# EAGLE board loa_v3 (EAGLE 6.5.0), part 1 of 2
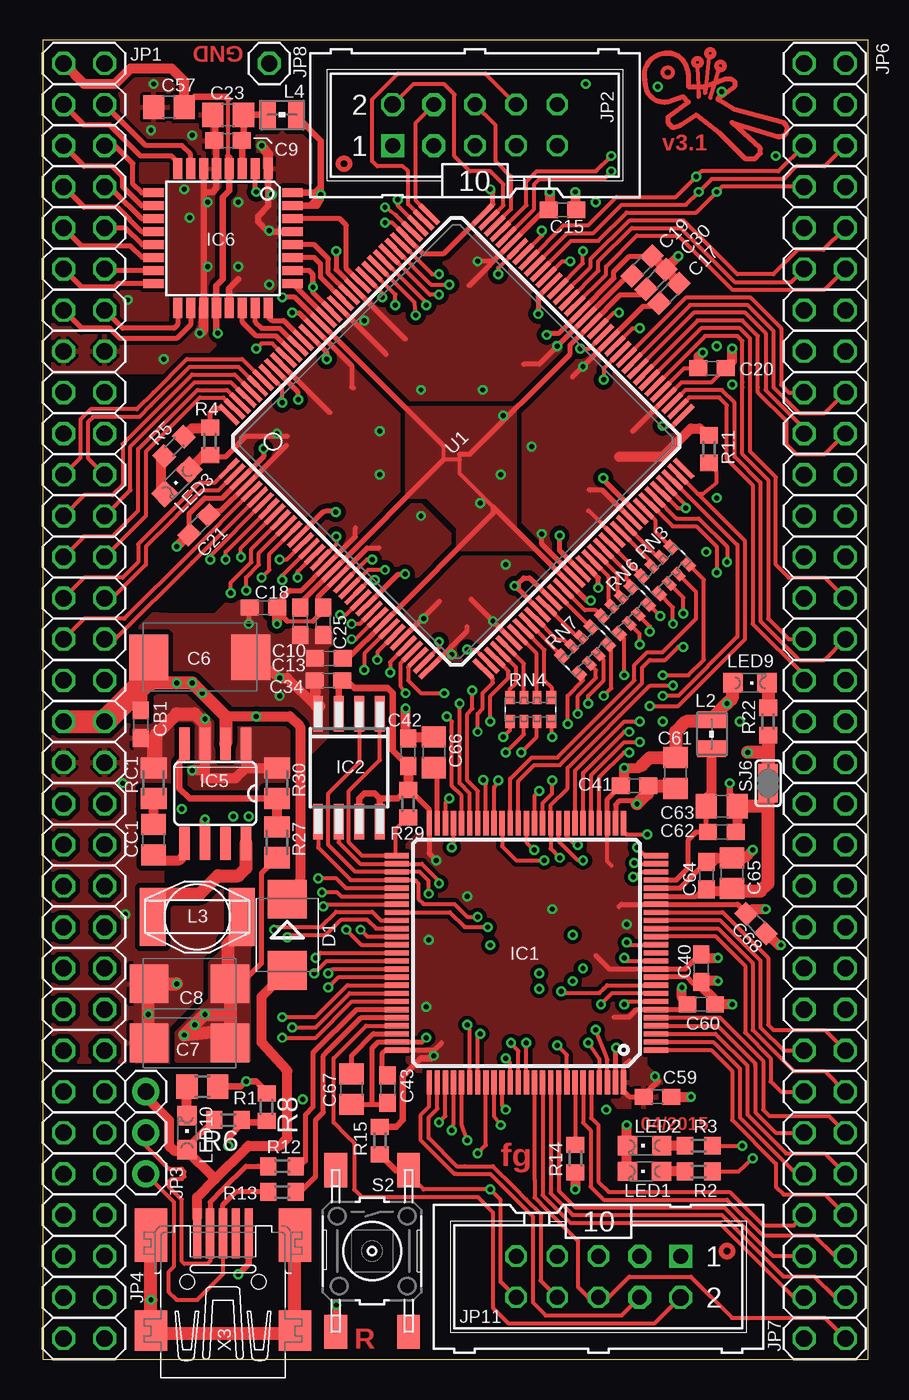
[diagram p7: board, top side]
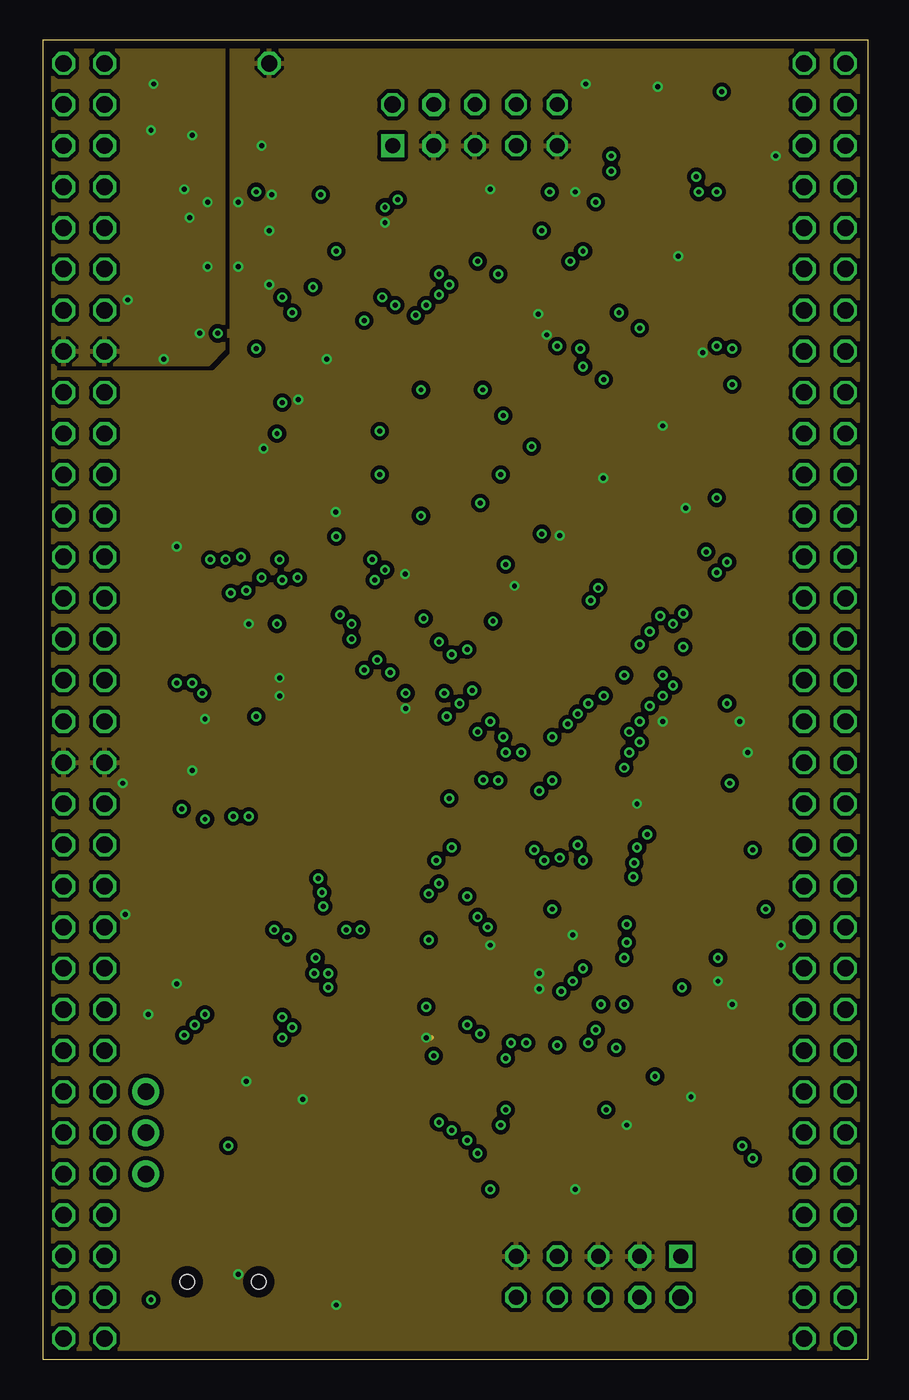
[diagram p8: board, inner layer GND]
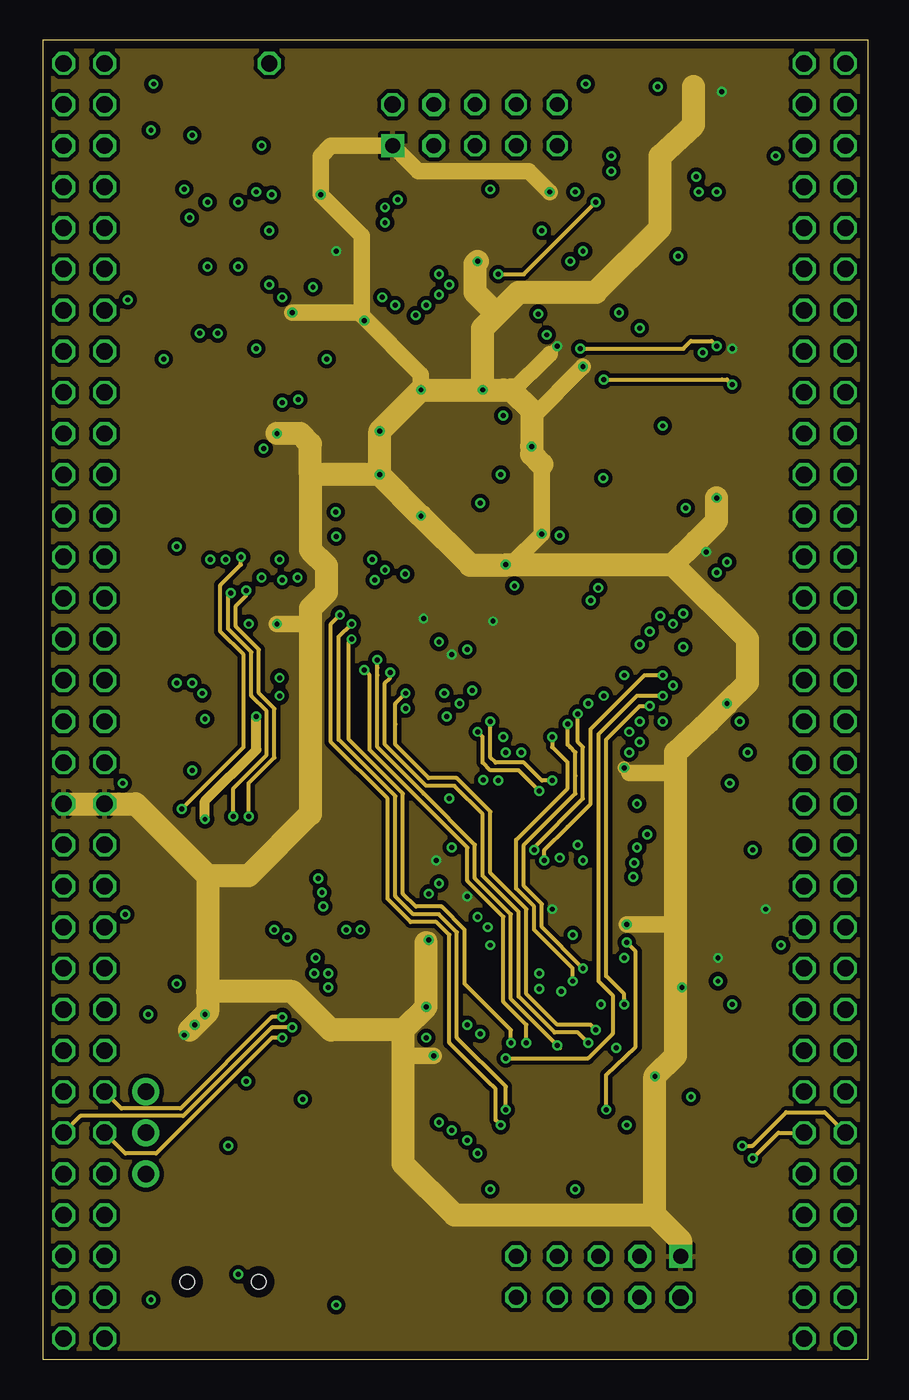
[diagram p9: board, inner layer Route15]
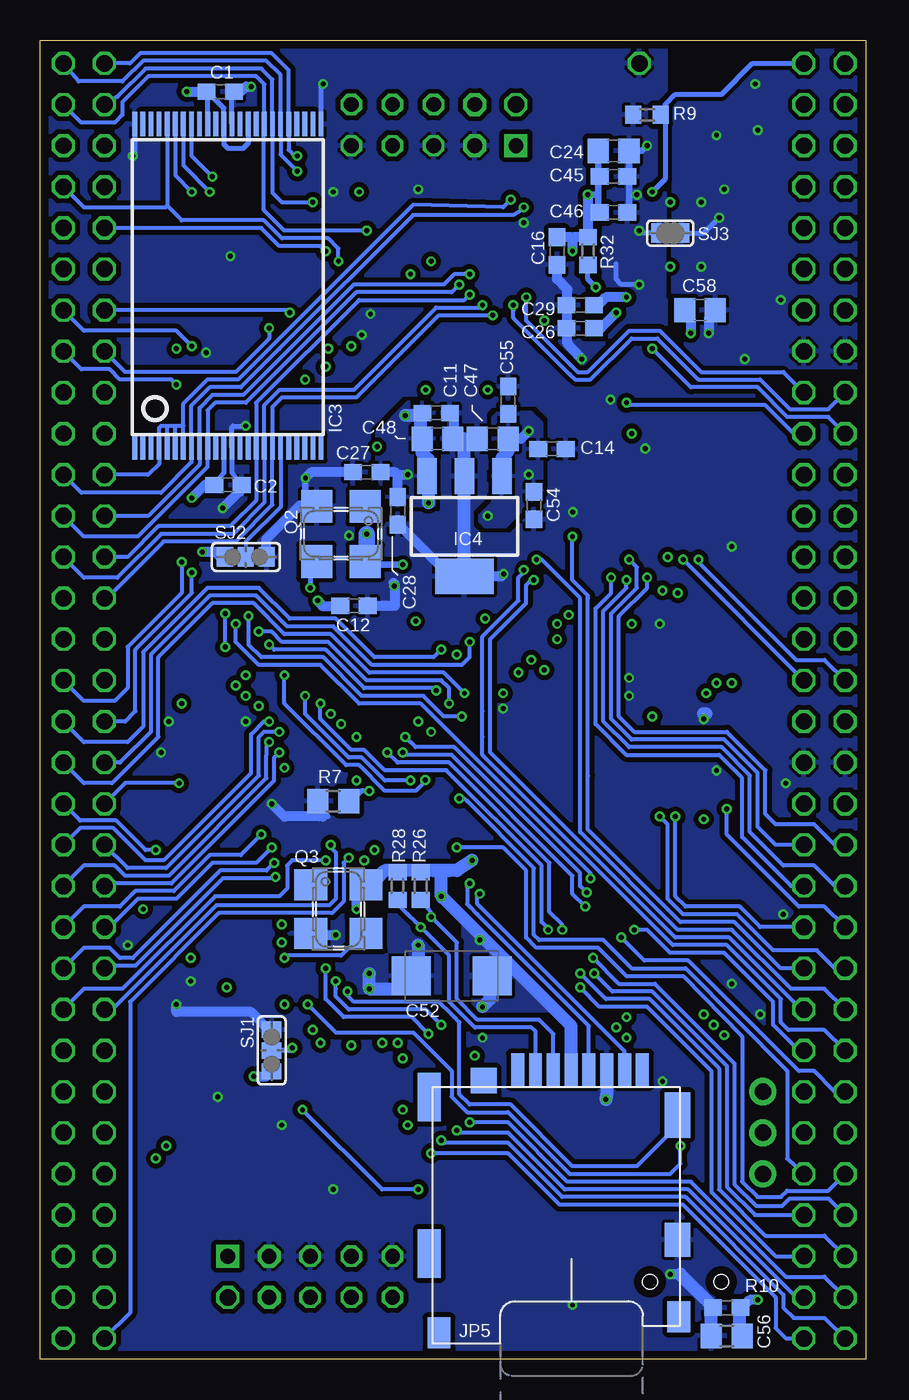
[diagram p10: board, bottom side, seen from below]

Size 50.94 x 81.43 mm. Coordinates in mm from the lower left corner, seen from the top.
Outline: 0,0 50.94,0 50.94,81.43 0,81.43 0,0
Copper layers (1+2*15+16): Top 0.035mm / dielectric 1.5mm / GND 0.035mm / dielectric 0.15mm / Route15 0.035mm / dielectric 0.2mm / Bottom 0.035mm
Design rules "PCB-POOL *": minimum track width 6mil, minimum drill 12mil, track to track 6mil, track to pad 6mil, pad to pad 6mil, via to via 6mil, smd to smd 6mil, copper to edge 20mil, drill to drill 8mil, minimum pad ring 8mil, minimum via ring 6mil, stop-mask expansion 12mil, vias tented up to drill 12mil, thermal gap 8mil

## Footprints (pad centres in the part's own frame; a part is rotated, then mirrored left to right if it is on the bottom)
C0603 = smd 1.1 x 1: 1 -0.85,0; 2 0.85,0
SMC_D = smd 2.4 x 2.8: + -3.15,0; - 3.15,0
SMC_C = smd 2.4 x 2.4: + -2.5,0; - 2.5,0
C0805 = smd 1.3 x 1.5: 1 -0.95,0; 2 0.95,0
SMB = smd 2.4 x 2.4: A 2.2,0; C -2.2,0
TQFP100 = smd 1.5 x 0.33: 1 -8,6; 2 -8,5.5; 3 -8,5; 4 -8,4.5; 5 -8,4; 6 -8,3.5; 7 -8,3; 8 -8,2.5; 9 -8,2; 10 -8,1.5; 11 -8,1; 12 -8,0.5; 13 -8,0; 14 -8,-0.5; 15 -8,-1; 16 -8,-1.5; 17 -8,-2; 18 -8,-2.5; 19 -8,-3; 20 -8,-3.5; 21 -8,-4; 22 -8,-4.5; 23 -8,-5; 24 -8,-5.5; 25 -8,-6; 51 8,-6; 52 8,-5.5; 53 8,-5; 54 8,-4.5; 55 8,-4; 56 8,-3.5; 57 8,-3; 58 8,-2.5; 59 8,-2; 60 8,-1.5; 61 8,-1; 62 8,-0.5; 63 8,0; 64 8,0.5; 65 8,1; 66 8,1.5; 67 8,2; 68 8,2.5; 69 8,3; 70 8,3.5; 71 8,4; 72 8,4.5; 73 8,5; 74 8,5.5; 75 8,6 | smd 0.33 x 1.5: 26 -6,-8; 27 -5.5,-8; 28 -5,-8; 29 -4.5,-8; 30 -4,-8; 31 -3.5,-8; 32 -3,-8; 33 -2.5,-8; 34 -2,-8; 35 -1.5,-8; 36 -1,-8; 37 -0.5,-8; 38 0,-8; 39 0.5,-8; 40 1,-8; 41 1.5,-8; 42 2,-8; 43 2.5,-8; 44 3,-8; 45 3.5,-8; 46 4,-8; 47 4.5,-8; 48 5,-8; 49 5.5,-8; 50 6,-8; 76 6,8; 77 5.5,8; 78 5,8; 79 4.5,8; 80 4,8; 81 3.5,8; 82 3,8; 83 2.5,8; 84 2,8; 85 1.5,8; 86 1,8; 87 0.5,8; 88 0,8; 89 -0.5,8; 90 -1,8; 91 -1.5,8; 92 -2,8; 93 -2.5,8; 94 -3,8; 95 -3.5,8; 96 -4,8; 97 -4.5,8; 98 -5,8; 99 -5.5,8; 100 -6,8
SO-08M = smd 0.6 x 2.2: 1 -1.905,-3.33; 2 -0.635,-3.33; 3 0.635,-3.33; 4 1.905,-3.33; 5 1.905,3.33; 6 0.635,3.33; 7 -0.635,3.33; 8 -1.905,3.33
TSOP48 = smd 1.5 x 0.3: 1 -9.909,5.75; 2 -9.909,5.25; 3 -9.909,4.75; 4 -9.909,4.25; 5 -9.909,3.75; 6 -9.909,3.25; 7 -9.909,2.75; 8 -9.909,2.25; 9 -9.909,1.75; 10 -9.909,1.25; 11 -9.909,0.75; 12 -9.909,0.25; 13 -9.909,-0.25; 14 -9.909,-0.75; 15 -9.909,-1.25; 16 -9.909,-1.75; 17 -9.909,-2.25; 18 -9.909,-2.75; 19 -9.909,-3.25; 20 -9.909,-3.75; 21 -9.909,-4.25; 22 -9.909,-4.75; 23 -9.909,-5.25; 24 -9.909,-5.75; 25 10.068,-5.75; 26 10.068,-5.25; 27 10.068,-4.75; 28 10.068,-4.25; 29 10.068,-3.75; 30 10.068,-3.25; 31 10.068,-2.75; 32 10.068,-2.25; 33 10.068,-1.75; 34 10.068,-1.25; 35 10.068,-0.75; 36 10.068,-0.25; 37 10.068,0.25; 38 10.068,0.75; 39 10.068,1.25; 40 10.068,1.75; 41 10.068,2.25; 42 10.068,2.75; 43 10.068,3.25; 44 10.068,3.75; 45 10.068,4.25; 46 10.068,4.75; 47 10.068,5.25; 48 10.068,5.75
SOT223 = smd 1.219 x 2.235: 1 -2.311,-3.099; 2 0,-3.099; 3 2.311,-3.099 | smd 3.6 x 2.2: 4 0,3.099
SO08 = smd 0.66 x 2.032: 1 -1.905,-3.073; 2 -0.635,-3.073; 3 0.635,-3.073; 4 1.905,-3.073; 5 1.905,3.073; 6 0.635,3.073; 7 -0.635,3.073; 8 -1.905,3.073
TQFP32-08 = smd 1.27 x 0.559: 1 -4.293,2.8; 2 -4.293,2; 3 -4.293,1.2; 4 -4.293,0.4; 5 -4.293,-0.4; 6 -4.293,-1.2; 7 -4.293,-2; 8 -4.293,-2.8; 17 4.293,-2.8; 18 4.293,-2; 19 4.293,-1.2; 20 4.293,-0.4; 21 4.293,0.4; 22 4.293,1.2; 23 4.293,2; 24 4.293,2.8 | smd 0.559 x 1.27: 9 -2.8,-4.293; 10 -2,-4.293; 11 -1.2,-4.293; 12 -0.4,-4.293; 13 0.4,-4.293; 14 1.2,-4.293; 15 2,-4.293; 16 2.8,-4.293; 25 2.8,4.293; 26 2,4.293; 27 1.2,4.293; 28 0.4,4.293; 29 -0.4,4.293; 30 -1.2,4.293; 31 -2,4.293; 32 -2.8,4.293
2X16 = drill 1.016 octagon: 1 -19.05,-1.27; 2 -19.05,1.27; 3 -16.51,-1.27; 4 -16.51,1.27; 5 -13.97,-1.27; 6 -13.97,1.27; 7 -11.43,-1.27; 8 -11.43,1.27; 9 -8.89,-1.27; 10 -8.89,1.27; 11 -6.35,-1.27; 12 -6.35,1.27; 13 -3.81,-1.27; 14 -3.81,1.27; 15 -1.27,-1.27; 16 -1.27,1.27; 17 1.27,-1.27; 18 1.27,1.27; 19 3.81,-1.27; 20 3.81,1.27; 21 6.35,-1.27; 22 6.35,1.27; 23 8.89,-1.27; 24 8.89,1.27; 25 11.43,-1.27; 26 11.43,1.27; 27 13.97,-1.27; 28 13.97,1.27; 29 16.51,-1.27; 30 16.51,1.27; 31 19.05,-1.27; 32 19.05,1.27
ML10 = drill 0.914 pad 1.422 square: 1 -5.08,-1.27 | drill 1.016 pad 1.422 octagon: 2 -5.08,1.27 | drill 0.914 pad 1.422 octagon: 3 -2.54,-1.27; 4 -2.54,1.27 | drill 0.914 octagon: 5 0,-1.27; 6 0,1.27; 7 2.54,-1.27; 8 2.54,1.27; 9 5.08,-1.27; 10 5.08,1.27
1X03S = drill 1.016 pad 1.676: 1 -2.54,0; 2 0,0; 3 2.54,0
SD_MOLEX_49225-0821 = smd 0.8 x 2: 1 -2.43,8.5; 2 -1.33,8.5; 3 -0.23,8.5; 4 0.87,8.5; 5 1.97,8.5; 6 3.07,8.5; 7 4.17,8.5; 8 5.27,8.5 | smd 1.4 x 1.9: 11 7.51,-6.75; 12 -7.29,-7.75 | smd 1.4 x 3: 13 -7.89,-2.85; 14 -7.89,6.8 | smd 1.6 x 1.55: 15 -4.53,7.825 | smd 1.55 x 2.8: SW1 7.435,5.7 | smd 1.55 x 2.1: SW2 7.435,-2
1X01 = drill 1.016 octagon: 1 0,0
WE-KI_0805_B = smd 1.02 x 1.78: 1 -0.89,0; 2 0.89,0
L-PISG = smd 1.6 x 3.6: 1 -2.75,0; 2 2.75,0
CHIPLED_0805 = smd 1.2 x 1.2: A 0,-1.05; C 0,1.05
XO53 = smd 1.93 x 2.032: 1 -1.5,-1.7; 2 1.5,-1.7; 3 1.5,1.7; 4 -1.5,1.7
R0805 = smd 1.3 x 1.5: 1 -0.95,0; 2 0.95,0
R0603 = smd 1 x 1.1: 1 -0.85,0; 2 0.85,0
M0805 = smd 1.3 x 1.6: 1 -0.95,0; 2 0.95,0
EXB38V = smd 0.6 x 0.8: 1 -1.275,-0.75; 4 1.275,-0.75; 5 1.275,0.75; 8 -1.275,0.75 | smd 0.5 x 0.8: 2 -0.4,-0.75; 3 0.4,-0.75; 6 0.4,0.75; 7 -0.4,0.75
B3F-10XX-SMD = smd 2.1 x 1.4: P1 -5,2.25; P2 5,2.25; P3 -5,-2.25; P4 5,-2.25
SJ_2S = smd 1 x 1.2: 1 -1.286,0; 2 0,0; 3 1.286,0
SJS = smd 1 x 1.2: 1 -0.683,0; 2 0.683,0
TQ144 = smd 1.6 x 0.3: P1 -11.1,8.75; P2 -11.1,8.25; P3 -11.1,7.75; P4 -11.1,7.25; P5 -11.1,6.75; P6 -11.1,6.25; P7 -11.1,5.75; P8 -11.1,5.25; P9 -11.1,4.75; P10 -11.1,4.25; P11 -11.1,3.75; P12 -11.1,3.25; P13 -11.1,2.75; P14 -11.1,2.25; P15 -11.1,1.75; P16 -11.1,1.25; P17 -11.1,0.75; P18 -11.1,0.25; P19 -11.1,-0.25; P20 -11.1,-0.75; P21 -11.1,-1.25; P22 -11.1,-1.75; P23 -11.1,-2.25; P24 -11.1,-2.75; P25 -11.1,-3.25; P26 -11.1,-3.75; P27 -11.1,-4.25; P28 -11.1,-4.75; P29 -11.1,-5.25; P30 -11.1,-5.75; P31 -11.1,-6.25; P32 -11.1,-6.75; P33 -11.1,-7.25; P34 -11.1,-7.75; P35 -11.1,-8.25; P36 -11.1,-8.75; P73 11.1,-8.75; P74 11.1,-8.25; P75 11.1,-7.75; P76 11.1,-7.25; P77 11.1,-6.75; P78 11.1,-6.25; P79 11.1,-5.75; P80 11.1,-5.25; P81 11.1,-4.75; P82 11.1,-4.25; P83 11.1,-3.75; P84 11.1,-3.25; P85 11.1,-2.75; P86 11.1,-2.25; P87 11.1,-1.75; P88 11.1,-1.25; P89 11.1,-0.75; P90 11.1,-0.25; P91 11.1,0.25; P92 11.1,0.75; P93 11.1,1.25; P94 11.1,1.75; P95 11.1,2.25; P96 11.1,2.75; P97 11.1,3.25; P98 11.1,3.75; P99 11.1,4.25; P100 11.1,4.75; P101 11.1,5.25; P102 11.1,5.75; P103 11.1,6.25; P104 11.1,6.75; P105 11.1,7.25; P106 11.1,7.75; P107 11.1,8.25; P108 11.1,8.75 | smd 0.3 x 1.6: P37 -8.75,-11.1; P38 -8.25,-11.1; P39 -7.75,-11.1; P40 -7.25,-11.1; P41 -6.75,-11.1; P42 -6.25,-11.1; P43 -5.75,-11.1; P44 -5.25,-11.1; P45 -4.75,-11.1; P46 -4.25,-11.1; P47 -3.75,-11.1; P48 -3.25,-11.1; P49 -2.75,-11.1; P50 -2.25,-11.1; P51 -1.75,-11.1; P52 -1.25,-11.1; P53 -0.75,-11.1; P54 -0.25,-11.1; P55 0.25,-11.1; P56 0.75,-11.1; P57 1.25,-11.1; P58 1.75,-11.1; P59 2.25,-11.1; P60 2.75,-11.1; P61 3.25,-11.1; P62 3.75,-11.1; P63 4.25,-11.1; P64 4.75,-11.1; P65 5.25,-11.1; P66 5.75,-11.1; P67 6.25,-11.1; P68 6.75,-11.1; P69 7.25,-11.1; P70 7.75,-11.1; P71 8.25,-11.1; P72 8.75,-11.1; P109 8.75,11.1; P110 8.25,11.1; P111 7.75,11.1; P112 7.25,11.1; P113 6.75,11.1; P114 6.25,11.1; P115 5.75,11.1; P116 5.25,11.1; P117 4.75,11.1; P118 4.25,11.1; P119 3.75,11.1; P120 3.25,11.1; P121 2.75,11.1; P122 2.25,11.1; P123 1.75,11.1; P124 1.25,11.1; P125 0.75,11.1; P126 0.25,11.1; P127 -0.25,11.1; P128 -0.75,11.1; P129 -1.25,11.1; P130 -1.75,11.1; P131 -2.25,11.1; P132 -2.75,11.1; P133 -3.25,11.1; P134 -3.75,11.1; P135 -4.25,11.1; P136 -4.75,11.1; P137 -5.25,11.1; P138 -5.75,11.1; P139 -6.25,11.1; P140 -6.75,11.1; P141 -7.25,11.1; P142 -7.75,11.1; P143 -8.25,11.1; P144 -8.75,11.1
32005-201 = smd 3.1 x 0.5: 1 3,1.6; 2 3,0.8; 3 3,0; 4 3,-0.8; 5 3,-1.6 | smd 2.5 x 2: M1 -3,-4.45; M2 -3,4.45 | smd 3.3 x 2: M3 2.9,4.45; M4 2.9,-4.45 | hole 0.9: 0,2.2; 0,-2.2

## Placement (x,y rotation side)
C1  100n  [C0603]  39.85,78.26 0 bottom
C2  100n  [C0603]  39.37,53.98 0 bottom
C6  22µ  [SMC_D]  9.68,43.34 0 top
C7  22µ  [SMC_C]  9.05,19.53 180 top
C8  22µ  [SMC_C]  9.05,23.18 180 top
C9  100n  [C0603]  11.43,75.25 180 top
C10  10n  [C0603]  15.88,45.56 270 top
C11  10n  [C0603]  26.51,58.42 0 bottom
C12  10n  [C0603]  31.59,46.51 0 bottom
C13  10n  [C0603]  17.65,43.27 180 top
C14  100n  [C0603]  19.37,56.2 0 bottom
C15  100n  [C0603]  32.07,70.96 0 top
C16  100n  [C0603]  19.05,68.42 270 bottom
C17  100n  [C0603]  38.64,65.82 45 top
C18  100n  [C0603]  13.61,46.4 180 top
C19  100n  [C0603]  36.99,67.5 45 top
C20  100n  [C0603]  41.3,61.19 180 top
C21  100n  [C0603]  9.62,51.53 225 top
C23  1µ  [C0805]  11.43,76.83 180 top
C24  1µ  [C0805]  15.56,74.61 0 bottom
C25  100n  [C0603]  17.3,45.56 270 top
C26  100n  [C0603]  17.62,63.66 180 bottom
C27  100n  [C0603]  30.8,54.77 180 bottom
C28  100n  [C0603]  28.89,52.39 270 bottom
C29  100n  [C0603]  17.62,65.09 180 bottom
C30  100n  [C0603]  37.85,66.67 45 top
C34  100n  [C0603]  17.62,41.91 180 top
C40  100n  [C0603]  40.64,24.13 270 top
C41  100n  [C0603]  36.51,35.4 0 top
C42  100n  [C0603]  22.54,37.47 90 top
C43  100n  [C0603]  21.27,16.67 270 top
C45  100n  [C0603]  15.56,73.03 0 bottom
C46  100n  [C0603]  15.56,70.8 0 bottom
C47  4µ7  [C0805]  23.02,56.83 180 bottom
C48  1µ  [C0805]  26.43,56.83 0 bottom
C52  22µ  [SMC_C]  25.56,23.65 180 bottom
C54  100n  [C0603]  20.48,52.7 270 bottom
C55  100n  [C0603]  22.07,59.21 90 bottom
C56  10n  [C0603]  8.57,3.17 180 bottom
C57  1µ  [C0805]  7.78,77.31 180 top
C58  1µ  [C0805]  10.23,64.77 0 bottom
C59  100n  [C0603]  37.94,16.19 0 top
C60  100n  [C0603]  40.64,21.91 0 top
C61  4µ7  [C0805]  39.05,36.2 270 top
C62  10n  [C0603]  41.91,32.54 0 top
C63  1µ  [C0805]  41.91,34.13 0 top
C64  10n  [C0603]  40.96,29.84 270 top
C65  1µ  [C0805]  42.55,30 270 top
C66  4µ7  [C0805]  24.13,37.47 90 top
C67  4µ7  [C0805]  19.05,16.67 270 top
C68  100n  [C0603]  44.02,26.88 315 top
CB1  100n  [C0603]  6.03,39.21 270 top
CC1  6n8  [C0805]  6.83,32.07 90 top
D1  MURS 140  [SMB]  15.08,26.19 270 top
IC1  STM32F10XVXT6  [TQFP100]  29.84,25.08 180 top
IC2  M25P80MW  [SO-08M]  18.89,36.51 180 top
IC3  S34ML04G100TFI000  [TSOP48]  39.37,66.2 90 bottom
IC4  MCP1825S-1202E/DB  [SOT223]  24.77,51.44 180 bottom
IC5  NCP3170  [SO08]  10.64,34.92 180 top
IC6  AD7265SU  [TQFP32-08]  11.11,69.22 270 top
JP1  [2X16]  2.54,60.96 270 top
JP2  CORTEX_JTAGW  [ML10]  26.67,76.2 0 top
JP3  [1X03S]  6.35,13.97 270 top
JP4  [2X16]  2.54,20.32 270 top
JP5  SD_DETECT  [SD_MOLEX_49225-0821]  19.05,9.37 0 bottom
JP6  [2X16]  48.26,60.96 270 top
JP7  [2X16]  48.26,20.32 270 top
JP8  GND  [1X01]  13.97,80.01 0 top
JP11  CORTEX_JTAGW  [ML10]  34.29,5.08 180 top
L2  0,47u  [WE-KI_0805_B]  41.27,38.58 270 top
L3  4µ7  [L-PISG]  9.53,27.31 0 top
L4  0,47u  [WE-KI_0805_B]  14.76,76.83 180 top
LED1  Red  [CHIPLED_0805]  37.15,11.59 90 top
LED2  Yellow  [CHIPLED_0805]  37.15,13.18 90 top
LED3  Green  [CHIPLED_0805]  8.27,54.18 135 top
LED9  Green  [CHIPLED_0805]  43.66,41.75 270 top
LED10  Blue  [CHIPLED_0805]  8.89,13.97 0 top
Q2  50.000  [XO53]  32.38,50.96 180 bottom
Q3  25.000  [XO53]  32.54,27.78 270 bottom
R1  2k2  [R0805]  9.84,16.83 180 top
R2  330  [R0603]  40.48,11.59 0 top
R3  330  [R0603]  40.48,13.18 0 top
R4  10k  [R0603]  10.32,56.67 270 top
R5  330  [R0603]  8.1,56.36 225 top
R6  1k  [R0603]  11.43,14.76 180 top
R7  2k2  [R0805]  32.86,34.45 0 bottom
R8  2k2  [R0603]  13.81,15.56 270 top
R9  10k  [R0603]  13.49,76.83 0 bottom
R10  1M  [R0805]  8.57,1.43 0 bottom
R11  330  [R0603]  41.12,56.2 90 top
R12  22  [R0603]  14.76,11.91 180 top
R13  22  [R0603]  14.76,10.32 180 top
R14  100k  [R0603]  32.86,12.38 90 top
R15  2k2  [R0603]  20.8,13.49 90 top
R22  330  [R0603]  44.77,39.37 90 top
R26  10k  [R0603]  27.46,29.21 90 bottom
R27  24k9  [M0805]  14.45,31.91 270 top
R28  10k  [R0603]  28.89,29.21 90 bottom
R29  10k  [R0603]  22.54,34.29 90 top
R30  8k06  [M0805]  14.45,35.56 270 top
R32  10k  [R0603]  17.14,68.42 90 bottom
RC1  4k99  [M0805]  6.83,35.56 270 top
RN3  100  [EXB38V]  38.41,48.71 45 top
RN4  100  [EXB38V]  30.1,40.11 0 top
RN6  100  [EXB38V]  35.94,46.24 45 top
RN7  100  [EXB38V]  33.47,43.77 45 top
S2  Reset  [B3F-10XX-SMD]  20.32,6.67 270 top
SJ1  PDR_ON  [SJ_2S]  36.67,19.05 270 bottom
SJ2  WP  [SJ_2S]  38.26,49.53 0 bottom
SJ3  AGND-GND  [SJS]  12.06,69.53 180 bottom
SJ6  [SJS]  44.77,35.56 270 top
U1  6SLX9TQG144  [TQ144]  25.52,56.66 45 top
X3  MINI-USB  [32005-201]  11.11,4.76 90 top

## Tracks (layer width: path | path; a pad name or v marks a point on that pad's centre or on a via)
!ADC_CS  (via drill 0.3)
  Top 0.305: U1.P126 16.67,65.86 16.67,66.99 | 16.67,66.99 16.45,67.22 IC6.26 | 16.67,66.99 16.67,66.52 v16.67,66.2
  Bottom 0.305: v16.67,66.2 17.14,66.67 R32.1 17.14,67.63
!RESET  (via drill 0.3)
  Top 0.254: IC1.14 36.17,25.58 v36.04,25.72 | S2.P1 22.86,11.38 22.86,11.11 23.5,10.48 v27.62,10.48 28.26,9.84 28.26,4.76 JP11.10
  Top 0.406: S2.P1 21.77,11.67 R15.1
  Route15 0.254: v34.77,15.4 34.77,17.54 36.59,19.29 36.59,25.16 v36.04,25.72 | v36.04,25.72
  Bottom 0.254: v27.62,10.48 29.84,10.48 v34.77,15.4
!SD_CS  (via drill 0.3)
  Top 0.254: IC1.58 25.12,27.58 26.04,26.67 v27.46,26.67
  Bottom 0.254: v27.46,26.67 | v27.46,26.67 27.78,26.99 28.26,27.46 29.05,28.26 29.21,28.36 R28.1 | JP5.2 20.38,20.22 20.64,20.48 24.13,20.48 25.72,22.07 25.72,24.92 v27.46,26.67
+3V3  (via drill 0.3)
  Top 0.254: IC1.28 34.84,30.72 35.08,30.48 | 16.95,45.84 16.99,46.04 | C18.1 14.45,46.51 | C21.1 10.48,52.39 | 43.5,27.46 C68.1 43.88,27.94 v44.61,27.78 | 15.08,45.56 16.67,45.56 | U1.P60 33.68,52.39 33.66,52.39 | U1.P76 39.43,60.33 41.27,60.33 42,61.05 C20.1 42.16,61.2 42.23,61.28 | 43.5,27.46 | 41.75,79.69 41.2,77.87 41.51,78.82 41.65,78.88 | 41.12,80.41 40.88,78.18 40.92,78.62 | 40.4,79.85 40.48,77.95 40.48,78.58 40.16,78.58
  Top 0.305: 20.74,50.09 20.01,50.09 U1.P20 16.99,47.07 16.99,46.04 | 19.28,51.33 19.28,50.78 U1.P18 15.97,47.47 15.24,47.47 14.29,46.51 14.45,46.51 | 15.04,56.44 U1.P4 10.99,52.39 10.48,52.39 | U1.P135 17.71,58.46 | 19.16,59.98 19.05,60.01 19.05,61.36 U1.P129 15.8,64.61 v15.4,64.61 | 21.19,62.05 U1.P125 | 22.37,62.99 19.56,65.8 U1.P122 18.1,67.26 v18.1,68.42 | 26.31,66.3 U1.P103 | 36.41,57.3 U1.P76 | 32.7,60.66 U1.P86 37.04,65.01 37.7,65.01 37.91,65.21 C17.1 | 29.67,61.42 29.69,61.44 30.64,61.44 U1.P90 35.79,66.58 C19.1 | U1.P63 34.53,53.66 33.81,53.66 33.71,53.69 | U1.P53 30.8,50.32 30.8,51.12 30.75,51 | U1.P42 26.41,46.93 | U1.P36 26.19,44.96 26.19,45.21 | U1.P31 24.48,46.78 | 11.43,23.34 12.22,23.18 13.49,24.45 13.49,30.01 R27.2 | v17.14,71.91 16.45,71.22 | R29.2 22.54,35.24 23.84,33.94 IC1.50 23.84,31.23 v24.29,30.8 | 36.2,18.41 35.84,18.13 IC1.100 35.84,16.54 36.2,16.19 C59.1 | 35.24,21.11 36.2,21.11 36.35,21.27 36.66,21.58 IC1.6 39.47,21.58 C60.1 | 34.13,24.92 34.97,24.08 IC1.11 39.64,24.08 40.48,24.92 40.58,24.92 C40.1 | 35.56,27.94 35.7,28.08 IC1.19 42.88,28.08 43.5,27.46 | 24.61,19.53 24.16,19.08 IC1.75 21.15,19.08 20.95,18.89 20.95,17.84 C43.1 | U1.P103 31.05,71.03 C15.1 | C25.1 16.95,45.84 | IC1.28 34.84,34.58 C41.1 | C18.1 14.29,46.35 14.61,46.04 | 14.61,46.04 | 14.61,46.04 15.08,45.56 | 16.67,45.56 17.3,46.2 | R4.2 10.16,55.72 | 10.16,55.72 | 10.16,55.72 11.27,55.72 12.54,56.99 15.08,56.99 | U1.P103 27.8,67.79 v26.83,67.79 | 41.67,77.79 42.7,77.15 45.72,76.36 arc-37 45.96,75.96 45.88,75.64 arc-37 45.4,75.49 42.55,76.36 44.29,74.77 44.29,74.45 43.97,74.14 43.34,74.14 41.75,75.72 40.32,76.83 39.37,76.2 38.89,76.04 38.58,76.36 38.58,76.68 39.85,77.63 39.53,77.95 38.58,77.63 arc-74 37.31,78.26 arc-23 37.15,79.53 arc-74 38.42,80.64 arc-60 39.53,80.17 arc-30 39.85,79.22 39.85,78.58
  Top 0.305: 41.67,77.79 42.7,78.58 42.7,78.9 42.47,79.06 42.15,79.06 41.65,78.88 41.04,78.66 40.92,78.62 40.8,78.58 39.85,78.58 | 39.85,78.58 | 39.85,78.58 40.16,78.58 | 41.67,77.79 v41.91,78.26
  Top 0.406: IC6.31 16.45,71.22 16.76,71.22 | 16.76,71.22 16.92,71.22 17.14,71.6 | 17.14,72.39 17.14,72.07 17.09,72.02 17.14,71.96 v17.14,71.91 17.14,71.6 | IC6.32 16.77,72.02 17.14,72.39 | C59.1 37.09,16.3 37.94,17.14 | 18.26,39.63 IC2.3 18.26,41.91 18.41,42.07 C34.1 18.57,42.07 19.21,41.43 21.27,41.43 21.59,41.12 21.59,37.57 C42.1 | IC2.7 19.53,34.61 19.84,34.92 20.48,34.92 20.8,34.61 | 20.8,34.61 IC2.8 | R29.2 22.44,35.14 21.91,34.61 20.8,34.61 | R15.2 21.8,14.34 22.23,14.76 22.23,17.46 23.34,18.57 23.97,18.57 v24.13,18.73 | 17.14,72.39 17.14,75.25 15.72,76.68 L4.1 | 16.76,71.22 17.14,71.6
  Top 0.61: R29.2 C42.1 22.49,36.67 | C41.1 35.72,35.46 35.72,35.4 35.88,35.56 v35.88,36.51 36.83,36.51 36.99,36.67 | 41.5,39.37 L2.1 41.37,39.37 41.43,39.69 | C7.+ 10.91,20.2 10.79,20.32 v8.73,20 | R11.2 40.54,57.47 40.01,57.47 38.26,55.72 35.56,55.72 | v31.27,72.07 31.27,71.91 31.27,71.12 31.41,71.1 C15.1 | 17.3,46.2 C25.1 | C18.1 14.46,46.37 14.45,46.35 v14.45,45.4 | R4.2 9.92,55.82 LED3.A | 43.5,27.46 43.81,27.78 v44.61,27.78 | 42.23,61.28 42.55,61.59 v42.55,62.39 | C40.1 40.64,24.92 40.8,24.77 v41.67,24.77 | 39.85,21.91 39.45,22.3 v39.45,22.94 | v42.23,40.48 | 42.55,41.75
  Top 0.813: L3.2 12.12,26.4 11.43,25.56 11.43,23.34 11.11,23.06 C8.+ 11.59,23.18 11.59,21.27 | 11.59,20.32 11.59,20.04 C7.+ | 11.59,20.32 11.59,21.27 | 41.43,39.69 v42.23,40.48 42.55,40.8 42.55,41.75 LED9.A | C61.1 37.46,37.15 36.99,36.67 | 41.5,39.37 39.69,39.37 39.05,38.73 C61.1 | 11.59,21.27 v10,21.27 8.89,20.16 v8.73,20 11.59,20.32
  Route15 0.254: v40.96,49.85 40.32,50.48
  Route15 0.61: v31.75,62.55 31.27,62.07 | 31.27,62.07
  Route15 0.813: 28.55,49.03 v28.57,49.05 28.89,49.05 | v35.88,36.51 36.2,36.2
  Route15 1.016: 28.89,49.05 v30.8,50.96 | v30.8,50.96 30.8,55.24 | 22.23,18.73 v24.13,18.73 | v23.34,59.85 23.34,60.8 19.68,64.45 19.68,64.61 | 19.68,64.61 19.68,69.37 v17.14,71.91 | v17.14,71.91 | v15.4,64.61 | v15.4,64.61 19.68,64.61 | 31.27,62.07 28.89,59.69 28.89,59.85 | v33.34,61.28 30.16,58.1 30.16,58.58 | v31.27,72.07 30,73.34 23.18,73.34 JP2.1 17.78,74.93 17.14,74.3 v17.14,71.91 | v36.04,26.83 39.05,26.83 | 36.2,36.2 39.05,36.2 | v30.8,50.96 | 23.65,25.72 v23.81,25.88 | v14.45,45.4 16.35,45.4 16.51,45.24 | v42.23,40.48 | v23.65,21.75
  Route15 1.422: 28.55,49.03 26.38,49.03 v23.34,52.07 v20.8,54.61 | 30.8,55.24 30.16,55.88 v30.16,56.36 30.16,58.58 28.89,59.85 28.42,59.85 v27.15,59.85 | v27.15,59.85 v23.34,59.85 v20.8,57.31 v20.8,54.61 | 37.78,8.89 25.4,8.89 22.23,12.06 22.23,18.73 22.23,20.32 | 37.78,8.89 v37.78,17.46 39.05,18.73 39.05,26.83 39.05,36.2 39.05,37.47 41.12,39.37 v42.23,40.48 43.5,41.75 43.5,44.45 38.89,49.05 | 37.78,8.89 | 38.89,49.05 36.2,49.05 35.08,49.05 v28.57,49.05 | 37.78,8.89 39.37,7.3 JP11.1 | v20.8,54.61 16.51,54.61 | 16.51,54.61 16.51,49.97 U1.P18 17.49,47.34 16.51,46.35 16.51,45.24 16.51,33.66 12.7,29.84 10.16,29.84 | 16.51,54.61 16.51,56.52 15.88,57.15 v14.45,57.15 | 22.23,20.32 v23.65,21.75 23.65,25.72 | 22.23,20.32 17.78,20.32 15.4,22.7 10.16,22.7 | JP4.5 JP4.6 5.71,34.29 10.16,29.84 | 10.16,29.84 10.16,22.7 | 10.16,22.7 10.16,21.43 9.05,20.32 | v27.15,59.85 27.15,63.66 28.02,64.53 | 28.02,64.53 29.37,65.88 34.13,65.88 38.1,69.85 38.1,74.3 40.16,76.2 40.16,78.58 | 38.89,49.05 40.32,50.48 41.59,51.75 v41.59,53.18 | v26.83,67.79 26.67,67.63 26.67,65.88 28.02,64.53
  Bottom 0.254: v26.19,28.57 | v26.19,28.57 26.11,28.5 | 40.62,78.18 C1.1 40.8,78.26 | C2.1 40.22,53.92
  Bottom 0.305: IC3.39 40.62,78.18 | IC3.12 39.62,54.73 C2.1 | IC3.34 38.12,75.07 38.42,74.77 39.37,74.77 39.62,75.02 IC3.37 39.62,77.24 40.48,78.11 40.48,78.26 C1.1 40.7,78.11 40.64,77.95
  Bottom 0.406: Q2.4 30.84,49.05 v28.57,49.05 | C24.1 16.51,73.13 | 16.51,73.13 C45.1 | 16.51,73.13 16.51,72.07 | 16.51,72.07 16.51,70.91 C46.1 | v17.14,71.91 16.67,71.91 16.51,72.07
  Bottom 0.61: v17.14,71.91 17.14,70.96 R32.2 18.04,69.27 18.1,69.22 | v37.78,17.46 36.97,17.46 SJ1.3 | v20.8,57.31 21.27,56.83 C47.1 | C26.1 16.35,63.66 v15.4,64.61 | 18.1,69.22 v18.1,68.42 | 18.1,69.22 18.15,69.27 C16.1 | v31.43,27.78 31.43,28.42 30.8,29.05 | 40.22,53.92 40.8,53.98 v41.59,53.18 | v41.91,78.26 40.8,78.26 | v40.96,49.85 40.16,49.85 39.85,49.53 SJ2.1
  Bottom 0.813: IC4.1 22.45,55.65 22.07,56.04 C47.1 | JP5.4 18.18,20.56 26.11,28.5 v26.19,28.57 26.19,30.16 | 26.19,30.16 26.67,30.16 27.68,30.16 R26.2 | R26.2 27.78,30.16 29.11,30.16 | 29.11,30.16 R28.2 | 29.11,30.16 29.69,30.16 30.16,29.69 30.48,29.18 Q3.4 | R26.2 27.5,30.1 | v23.65,21.75 | v23.65,21.75 23.18,22.23 23.18,23.54 C52.+ | v24.29,30.8 | v24.29,30.8 25.24,30.16 25.72,30.16 26.19,30.16
  Bottom 1.016: v30.8,50.96 30.8,49.85 31.11,49.53 | Q3.4 30.84,29.1 30.8,29.05
  other vias: 19.84,64.14 25.24,43.5 23.5,45.72 27.78,45.56 9.37,20.64
  pour Top (isolate 0.305, rank 6): 25.96,43.19 25.07,43.19 12.05,56.21 12.05,57.11 25.07,70.13 25.96,70.13 38.99,57.11 38.99,56.21
  pour Top (isolate 0.254): 23.18,17.78 22.54,18.41 22.54,31.75 23.18,32.38 36.51,32.38 37.15,31.75 37.15,18.1 38.1,17.14 38.1,16.19 37.47,15.56 35.56,15.56 33.34,17.78
  pour Bottom (isolate 0.254, rank 5): 20,53.66 20,57.78 20.64,58.42 22.7,58.42 23.02,58.1 23.02,52.86 23.81,52.07 23.81,51.75 23.5,51.44 22.23,51.44
  pour Route15 (isolate 0.254, rank 6): -0.64,81.92 51.44,81.92 51.44,-0.64 -0.64,-0.64
  pour Bottom (isolate 0.305, rank 4): 19.05,21.59 24.13,21.59 24.77,22.23 24.77,27.3
  pour Top (isolate 0.305, rank 2, no thermals): 11.59,27.3 12.86,27.3 12.86,25.56 12.7,25.4 12.7,18.41 8.26,18.41 8.26,20.16 10.32,22.23 10.32,24.45 11.11,25.24 11.11,25.72 11.59,26.19
ADC_A0
  Top 0.305: U1.P127 IC6.25
ADC_A1
  Top 0.305: U1.P131 14.86,64.14 14.13,64.14 13.91,64.35 IC6.24
ADC_A2
  Top 0.305: U1.P132 14.63,63.66 13.49,63.66 13.11,64.04 IC6.23
ADC_CLK
  Top 0.305: U1.P124 17.14,66.8 17.14,67.63 16.76,68.02 IC6.27
ADC_DOUTA
  Top 0.305: U1.P121 18.73,67.33 18.73,70.01 18.33,70.42 IC6.30
ADC_DOUTB
  Top 0.305: U1.P123 17.62,67.03 17.62,67.94 16.75,68.81 IC6.28
ADC_SGL_DIFF
  Top 0.305: U1.P133 14.4,63.18 13.18,63.18 12.31,64.05 IC6.22
AGND  (via drill 0.3)
  Top 0.406: IC6.19 IC6.6 9.92,73.46 9.92,72.07 10.48,72.07 10.71,72.31 IC6.5 10.71,75.11 C9.2 10.64,75.25 10.64,76.68 C23.2
  Top 0.61: IC6.19 9.91,63.57 v9.68,63.34
  Bottom 0.305: SJ3.1 10,69.53 v9.05,70.48
  Bottom 0.61: C58.2 9.28,64.7 9.68,64.29 v9.68,63.34
  other vias: 8.73,72.23 10.16,67.47 10.16,71.44 9.21,75.56 6.83,78.74 6.67,75.88 5.24,65.4 7.46,61.75
  pour Top (isolate 0.254, rank 5): -0.64,81.6 11.11,81.6 11.11,63.18 8.89,60.96 -0.64,60.96
  pour GND (isolate 0.254, rank 5): 0,81.28 9.53,81.44 11.11,81.44 11.11,62.39 10.16,61.44 0.64,61.44
  pour Bottom (isolate 0.254, rank 5): -0.64,81.92 11.75,81.92 11.91,63.34 11.91,61.91 11.11,61.28 -0.64,61.28
DONE  (via drill 0.3)
  Top 0.254: IC1.7 36.05,22.08 v35.88,21.91 | 40.41,53.43 U1.P71 | 40.41,53.43 43.34,50.51 43.34,44.45 39.21,40.32 v37.47,40.32 | R11.1 41.12,55.4 41.59,54.77 41.59,54.13 40.73,53.43 40.41,53.43
  Route15 0.254: v35.88,21.91 35.88,22.54 34.77,23.65 34.77,38.26 36.83,40.32 v37.47,40.32
FPGA_CLK  (via drill 0.3)
  Top 0.305: U1.P55 34.29,48.24 v34.29,47.62
  Bottom 0.305: Q2.3 33.81,49.26 U1.P55 34.04,48.99 34.29,48.74 v34.29,47.62
FPGA_TCK
  Top 0.254: U1.P109 23.02,71.53 23.02,76.36 JP2.4
FPGA_TDI
  Top 0.254: U1.P110 22.54,71.3 22.54,73.34 22.23,73.66 20.64,73.66 20.32,73.98 20.32,77.79 21.91,79.38 27.3,79.38 JP2.8
FPGA_TDO
  Top 0.254: U1.P106 28.89,71 28.89,73.03 27.94,73.98 27.94,76.2 JP2.6
FPGA_TMS
  Top 0.254: U1.P107 28.42,71.23 28.42,72.55 27.62,73.34 26.35,73.34 25.4,74.3 25.4,78.11 24.77,78.74 22.86,78.74 JP2.2
FSMC_CLK  (via drill 0.3)
  Top 0.254: IC1.84 27.84,14.99 v28.26,14.45 | U1.P24 18.7,45.96 v18.34,45.96
  Route15 0.254: v28.26,14.45 | v28.26,14.45 27.94,14.76 27.94,16.67 27.46,17.14 | 27.46,17.14 | 27.46,17.14 25.08,19.53 25.08,26.19 24.29,26.99 22.7,26.99 | 22.7,26.99 | 22.7,26.99 21.27,28.42 21.27,34.61 17.78,38.1 17.78,45.4 v18.34,45.96
FSMC_D0  (via drill 0.3)
  Top 0.254: v19.61,26.51 19.68,26.43 20.03,26.08 IC1.61 | v33.66,40.48 33.66,40.96 34.61,41.91 34.61,43.2 RN7.3
  Bottom 0.254: v19.61,26.51 19.61,26.59 20,26.99 20,30.48 25.88,36.35 29.69,36.35 30.96,37.62 31.75,37.62 33.66,39.53 v33.66,40.48
FSMC_D1  (via drill 0.3)
  Top 0.254: IC1.62 19.66,25.58 v18.73,26.51 | v29.53,37.47 30.48,38.42 30.48,39.34 RN4.3
  Bottom 0.254: v18.73,26.51 18.73,26.83 19.53,27.62 19.53,30.64 25.72,36.83 28.89,36.83 v29.53,37.47
FSMC_D2  (via drill 0.3)
  Top 0.254: IC1.81 26.34,20.49 v26.19,20.64 | RN4.4 31.37,38.48 v31.43,38.42
  Route15 0.254: v32.7,23.34 32.7,24.13 30.32,26.51 30.32,27.94 29.21,29.05 29.21,32.07 32.38,35.24 32.38,36.83 31.43,37.78 v31.43,38.42
  Bottom 0.254: v32.7,23.34 32.7,23.18 32.7,22.86 32.7,22.38 31.91,21.59 27.15,21.59 v26.19,20.64
FSMC_D3  (via drill 0.3)
  Top 0.254: IC1.82 26.84,19.94 v26.99,20.08 | v32.38,39.21 32.38,40.96 33.34,41.91 33.34,42.1 RN7.1
  Route15 0.254: v33.34,24.13 30.8,26.67 30.8,28.1 29.69,29.21 29.69,31.75 32.86,34.92 32.86,36.04 32.86,37.47 32.54,37.78 32.38,37.94 v32.38,39.21
  Bottom 0.254: v33.34,24.13 33.18,24.13 33.34,23.97 33.34,22.23 32.23,21.11 28.02,21.11 v26.99,20.08
FSMC_D4  (via drill 0.3)
  Top 0.254: IC1.38 29.84,31.91 v30.32,31.43 | v33.02,39.85 33.02,40.96 34.13,42.07 34.13,42.54 RN7.2
  Route15 0.254: v30.32,31.43 30.32,31.59 33.34,34.61 33.34,37.78 33.02,38.1 v33.02,39.85
FSMC_D5  (via drill 0.3)
  Top 0.254: IC1.39 29.34,35.7 30.32,36.67 31.91,36.67 36.99,41.75 36.99,42.7 37.47,43.18 38.42,43.18 39.21,43.97 v39.53,43.97 | v39.53,46.04 39.53,47.02 RN3.2
  Bottom 0.254: v39.53,43.97 v39.53,46.04
FSMC_D6
  Top 0.254: IC1.40 28.84,35.83 30.16,37.15 31.75,37.15 36.51,41.91 36.51,42.86 37.31,43.66 38.26,43.66 40.32,45.72 40.32,47.36 RN3.3
FSMC_D7  (via drill 0.3)
  Top 0.254: IC1.41 28.34,31.66 29.21,30.8 v30.96,30.8 | v38.26,42.23 39.85,42.23 40.8,43.18 40.8,48.12 RN3.4
  Route15 0.254: v30.96,30.8 30.96,31.43 32.38,32.86 33.81,34.29 33.81,38.89 37.15,42.23 v38.26,42.23
FSMC_D8  (via drill 0.3)
  Top 0.254: IC1.42 27.84,35.31 v28.1,35.72 | v34.61,40.96 35.08,41.43 35.08,43.96 RN7.4
  Bottom 0.254: v28.1,35.72 29.69,35.72 31.11,37.15 31.91,37.15 34.61,39.85 v34.61,40.96
FSMC_D9  (via drill 0.3)
  Top 0.254: IC1.43 27.34,35.52 27.3,35.56 v27.19,35.76 | v35.88,42.23 35.88,44.5 RN6.1
  Bottom 0.254: v27.19,35.76 27.34,35.52 27.78,35.08 29.69,35.08 31.27,36.67 32.07,36.67 35.88,40.48 v35.88,42.23
FSMC_D10  (via drill 0.3)
  Top 0.254: IC1.44 26.84,35.07 26.19,35.72 26.19,39.85 26.51,40.16 v26.51,41.27 | v26.51,41.27 | v36.83,44.13 36.83,44.78 RN6.2
  Bottom 0.254: v26.51,41.27 26.67,41.43 30.96,41.43 33.34,43.81 36.51,43.81 v36.83,44.13
FSMC_D11  (via drill 0.3)
  Top 0.254: IC1.45 26.34,34.93 25.72,35.56 25.72,40.01 v25.72,40.48 | v25.72,40.48 | RN6.3 36.75,45.96 37.47,45.24 37.47,45.09 v37.47,44.93
  Bottom 0.254: v25.72,40.48 25.72,41.43 26.19,41.91 30.8,41.91 33.18,44.29 36.04,44.29 36.67,44.93 v37.47,44.93
FSMC_D12  (via drill 0.3)
  Top 0.254: IC1.46 25.84,34.8 25.24,35.4 25.24,39.37 v24.92,39.69 | RN6.4 v38.1,45.88
  Bottom 0.254: v24.92,39.69 26.04,39.69 27.3,40.96 31.11,40.96 33.5,43.34 37.31,43.34 38.1,44.13 v38.1,45.88
FSMC_D13  (via drill 0.3)
  Top 0.254: IC1.55 18.7,29.08 18.1,29.69 v16.99,29.69 | v38.89,45.4 38.89,46.42 RN3.1
  Bottom 0.254: v16.99,29.69 16.99,30 27.3,40.32 27.46,40.48 31.27,40.48 33.66,42.86 37.47,42.86 38.89,44.29 v38.89,45.4
FSMC_D14  (via drill 0.3)
  Top 0.254: IC1.56 18.41,28.58 18.18,28.81 v17.22,28.81 | RN4.1 28.82,38.83 v28.42,38.42
  Bottom 0.254: v17.22,28.81 | v17.22,28.81 17.62,29.21 17.62,29.37 17.62,30 25.4,37.78 27.78,37.78 v28.42,38.42 28.1,38.1
FSMC_D15  (via drill 0.3)
  Top 0.254: IC1.57 17.48,28.08 v17.3,27.94 | v28.57,37.47 29.69,38.58 29.69,39.35 RN4.2
  Bottom 0.254: v17.3,27.94 | v17.3,27.94 | v17.3,27.94 18.1,28.73 | 18.1,28.73 | 18.1,28.73 18.1,29.84 25.56,37.31 28.1,37.31 | 28.1,37.31 | 28.1,37.31 28.42,37.31 v28.57,37.47
FSMC_NADV  (via drill 0.3)
  Top 0.254: IC1.93 32.34,18.77 v31.75,19.37 | U1.P30 20.64,43.65 v20.64,43.18
  Route15 0.254: 31.91,19.21 v31.75,19.37 31.91,19.21 | 31.91,19.21 28.89,22.23 28.89,27.46 26.67,29.69 26.67,31.75 | 26.67,31.75 | 26.67,31.75 23.5,34.92 | v20.64,43.18 20.64,42.7 20.64,42.23 20.64,37.78 23.5,34.92 | 23.5,34.92
FSMC_NBL0  (via drill 0.3)
  Top 0.254: IC1.97 34.34,18.52 v33.66,19.53 | v33.66,19.53 | U1.P32 21.43,43.03 v21.43,42.39
  Route15 0.254: v33.66,19.53 | v33.66,19.53 33.02,20.16 31.59,20.16 29.37,22.38 29.37,27.62 27.15,29.84 27.15,33.66 25.4,35.4 23.65,35.4 21.11,37.94 21.11,41.75 21.43,42.07 v21.43,42.39
FSMC_NBL1  (via drill 0.3)
  Top 0.254: IC1.98 34.84,18.5 34.77,18.73 v34.13,20.32 | v22.38,41.12 22.07,41.59 22.07,42.96 U1.P33
  Route15 0.254: v34.13,20.32 33.81,20.64 31.75,20.64 29.84,22.54 29.84,27.78 27.62,30 27.62,33.81 25.56,35.88 | v22.38,41.12 22.23,40.96 21.75,40.48 21.75,39.21 21.75,37.94 23.81,35.88 25.56,35.88 | 25.56,35.88
FSMC_NE1  (via drill 0.3)
  Top 0.254: IC1.88 v29.84,19.53 | U1.P29 19.84,43.57 19.84,43.5 v19.84,42.55
  Route15 0.254: v29.84,19.53 29.84,20.64 28.42,22.07 28.42,27.3 26.19,29.53 26.19,31.59 23.34,34.45 20.16,37.62 | 20.16,37.62 | 20.16,37.62 20.16,38.26 20.16,42.07 20.16,42.23 v19.84,42.55
FSMC_NOE  (via drill 0.3)
  Top 0.254: IC1.85 28.34,15.64 v28.57,15.4 | U1.P26 19.56,45.4 v19.05,45.4
  Route15 0.254: v28.57,15.4 28.57,16.83 25.56,19.84 25.56,26.35 | 25.56,26.35 | 25.56,26.35 | 25.56,26.35 | 25.56,26.35 | 25.56,26.35 24.45,27.46 22.86,27.46 | 22.86,27.46 | 22.86,27.46 | 22.86,27.46 21.75,28.57 21.75,34.77 18.26,38.26 18.26,44.61 v19.05,45.4
FSMC_NWAIT  (via drill 0.3)
  Top 0.254: IC1.87 29.34,19.03 v28.89,19.53 | U1.P27 19.31,44.45 v19.05,44.45
  Route15 0.254: v28.89,19.53 28.89,20.32 26.04,23.18 26.04,26.51 24.61,27.94 23.02,27.94 22.23,28.73 22.23,34.92 18.89,38.26 | 18.89,38.26 | 18.89,38.26 | 18.89,38.26 | 18.89,38.26 18.89,44.29 v19.05,44.45 | v19.05,44.45
FSMC_NWE  (via drill 0.3)
  Top 0.254: U1.P70 42.86,50.28 42.86,44.61 39.21,40.96 v38.26,40.96 | IC1.86 28.84,18.3 v28.57,18.57
  Route15 0.254: v38.26,40.96 36.67,40.96 34.29,38.58 34.29,23.34 35.16,22.46 35.16,20.08 33.66,18.57 v28.57,18.57
GND  (via drill 0.3)
  Top 0.254: v29.11,47.75 29.33,47.91 | C68.2 44.53,26.27 44.61,26.19 | U1.P77 39.58,61.19 C20.2 40.45,61.15 40.48,61.12 | U1.P113 21.56,70.17 v21.11,70.17 | U1.P69 39.69,52.74 v39.69,52.55 39.18,52.55 U1.P68 | v31.1,63.25
  Top 0.305: U1.P25 21.92,48.47 v22.35,48.47 | U1.P13 17.27,52.31 17.51,52.39 17.94,52.39 v18.07,52.3 | v13.62,56.21 13.66,55.76 U1.P3 11.07,53.18 10,53.18 9.02,52.2 C21.2 | U1.P136 15.75,59.71 v15.75,59.24 | U1.P130 17.52,62.19 v17.52,61.74 | U1.P96 30.57,65.6 v30.57,64.54 | v31.1,63.25 31.19,63.34 31.84,63.34 32.38,63.88 U1.P91 35.24,66.74 35.24,67.15 36.2,68.1 36.29,68.1 C19.2 | U1.P64 34.58,54.31 v34.58,54.4 | U1.P54 31.89,49.93 v31.89,50.85 | U1.P49 30.05,48.24 29.67,48.24 29.33,47.91 29.33,47.54 U1.P47 | 20.32,15.72 20.32,19.21 20.69,19.58 IC1.74 23.39,19.58 v23.65,19.84 | 20.32,15.72 C67.2 | 20.32,15.72 21.17,15.72 C43.2 | IC1.10 39.76,23.58 40.16,23.18 40.54,23.18 C40.2 40.64,23.02 | 41.43,22.23 41.43,21.96 C60.2 | IC1.27 35.34,34.23 35.56,34.45 36.51,34.45 v36.67,34.29 | U1.P113 23.46,68.26 24.74,68.26 U1.P108 27.78,71.3 27.78,72.07 v27.62,72.23 | U1.P73 38.85,57.63 v38.26,57.63 | C18.2 12.75,46.4 12.7,46.35 v12.7,45.4
  Top 0.406: IC6.29 13.89,69.61 13.28,70.22 13.28,70.59 13.91,71.22 IC6.1 | IC6.21 11.51,66.12 12.06,66.67 | X3.5 12.71,5.89 v12.06,5.24 | R1.1 12.22,16.83 v12.54,17.14 13.18,17.14 13.81,16.51 R8.1 | S2.P4 18.07,1.56 18.1,1.59 v18.1,3.33
  Top 0.61: RC1.1 | 12.54,36.51 R30.1 14.45,36.67 | 12.54,36.51 12.54,37.15 IC5.1 | 12.54,36.51 11.91,35.88 10,35.88 10,36.35 | 10,37.15 10,36.35 | IC6.1 13.91,74.4 v13.49,74.93 | 16.83,41.06 C34.2 16.83,40.8 17.14,40.32 16.83,40.32 15.08,42.07 v14.61,42.07 | 24.29,38.42 C66.2 | 24.29,38.42 | 24.29,38.42 22.49,38.42 C42.2 22.38,38.26 | 22.38,38.26 | 22.38,38.26 v22.38,40.16 | C6.- v14.61,42.07 | v14.61,42.07 | 10,36.35 v9.21,36.35 | 41.43,22.23 40.64,23.02 | R14.1 32.86,11.43 32.86,10.79 v32.86,10.48 | v42.55,21.91 C60.2 | LED1.C 36.04,11.81 36.04,13.18 LED2.C 36.04,13.12 | C68.2 44.73,26.16 44.58,26.16 | 44.58,26.16 44.61,26.35 | 44.58,26.16 44.77,26.19 45.4,25.56 | 45.4,25.56 | 45.4,25.56 v45.56,25.56 | C19.2 | C19.2 37.62,68.1 C30.2 39.21,66.52 39.21,66.45 C17.2 | v39.21,68.1 38.42,67.31 37.78,67.94 | v32.86,72.07 32.86,70.96 C15.2 | v8.26,50.16 | v8.26,50.16 9.05,50.96 | C59.2 v40.01,16.19 | 36.04,13.12 36.04,13.02 | 36.04,13.12 v36.04,14.45 | R22.1 44.77,38.58 | 40.48,61.12 40.48,61.91 v40.72,62.15 | v41.67,23.34 40.7,23.34
  Top 0.813: 10,37.15 IC5.3 10,39.21 9.37,39.85 8.26,39.85 6.99,38.58 6.99,36.99 RC1.1 6.83,36.67 6.83,38.04 CB1.2 | 6.03,20 5.91,19.88 C7.- 6.51,20.04 6.51,23.18 C8.- 7.3,23.18 v8.26,23.18 | v36.67,34.29 | v36.67,34.29 37.31,34.92 37.31,35.34 C41.2 38.9,35.4 C61.2 | v43.5,37.47 44.45,37.47 44.77,37.15 SJ6.1 44.77,38.58
  GND 0.305: v23.65,19.84 23.97,19.84
  Bottom 0.254: 38.26,57.47 v38.26,57.63 | 38.52,53.4 C2.2 38.52,53.71 | C1.2 38.89,78.26
  Bottom 0.305: 15.4,67.63 15.4,66.67 15.08,66.36 v13.97,66.36 | R7.1 33.18,33.5 33.5,33.5 | IC3.25 33.62,78.62 v33.5,78.74 | IC3.48 45.12,74.42 v45.24,74.3 | IC3.36 39.12,78.14 C1.2 | C2.2 39.12,54.73 IC3.13 39.12,57.56 39.05,57.63 v38.26,57.63 | SJ3.2 13.81,69.53 v13.97,69.69
  Bottom 0.406: Q2.2 33.97,52.7 34.09,52.7 34.58,53.35 v34.58,54.4 | C46.2 14.61,70.8 | 14.61,70.8 | 14.61,70.8 14.61,71.91 | 14.61,71.91 14.61,72.92 | 14.61,72.92 C45.2 | v14.13,71.91 14.61,71.91 | 14.61,71.91 | 14.61,72.92 C24.2 | v13.49,74.93 | v13.49,74.93 13.81,74.61 C24.2
  Bottom 0.61: v10,39.53 10,39.85 | Q3.2 34.36,26.28 34.61,26.19 v32.7,26.19 | SJ1.1 36.85,20.34 37.94,21.43 42.55,21.43 v42.55,21.91 | 33.5,33.5 35.88,33.5 v36.67,34.29 | 18.41,63.5 18.41,62.71 18.11,62.38 v17.52,61.74 | 18.41,63.5 18.41,65.09 18.41,64.93 C29.2 18.41,65.14 18.41,66.04 19.05,66.67 C16.2 | C12.2 29.05,46.51 29.05,47.78 29.14,47.94 v29.11,47.75 | C27.2 34.21,54.77 v34.58,54.4 | C28.2 28.73,51.44 26.19,48.9 25.32,48.9 IC4.4 22.48,48.34 v22.35,48.47 | 25.4,56.83 25.4,58.32 C11.2 | C26.2 18.47,63.56 18.41,63.5 | 11.43,5.24 v12.06,5.24 | v39.69,52.55 38.52,53.71 | 38.89,78.26 38.58,78.26 38.26,78.58 v37.94,78.58 | Q2.2 33.93,52.7 34.92,52.7 36.99,50.64 36.99,49.53 SJ2.3
  Bottom 0.813: 24.77,56.83 IC4.2 IC4.4 | 24.77,56.83 C47.2 | 24.77,56.83 25.4,56.83 C48.2 | R10.1 | R10.1 | R10.1 9.53,1.27 9.53,3.12 C56.2 9.42,3.23 11.43,5.24 | 10,39.85 9.84,39.85 | JP5.6 15.98,16.46 v16.03,16.03 | v27.62,25.56 27.62,24.09 C52.- | v30.64,23.81 v30.64,22.86 28.89,22.86 27.94,23.81
  other vias: 12.06,67.47 12.06,71.44 6.51,21.27 5.08,27.46 4.92,35.56 14.61,40.96 38.26,39.37 43.02,39.37
  pour GND (isolate 0.254, rank 6): -0.64,81.92 51.44,81.92 51.44,-0.64 -0.64,-0.64
  pour Top (isolate 0.305, rank 6): 12.38,78.74 16.51,78.74 16.51,72.71 15.24,71.44 15.24,65.72 14.61,65.09 11.43,65.09 11.43,77.79
  pour Top (isolate 0.305, rank 6, no thermals): 5.71,18.41 11.75,18.41 12.38,19.05 12.38,33.34 17.78,38.73 17.78,44.77 17.46,45.09 15.4,45.09 13.81,46.67 11.43,46.67 10.64,45.88 8.1,45.88 5.71,46.04
  pour Bottom (isolate 0.254, rank 6): 21.27,46.67 23.5,44.45 30.16,44.45 31.43,45.72 34.61,45.72 34.92,46.04 34.92,55.56 28.57,61.91 20,61.91 17.78,59.69 17.78,51.44 21.27,47.94
  pour Bottom (isolate 0.305, rank 6): -0.64,-0.64 51.44,-0.64 51.44,81.92 12.38,81.92 12.38,61.75 11.59,60.96 -0.64,60.96
  pour Top (isolate 0.305, rank 6): -1.91,18.41 7.3,18.41 7.46,45.88 -1.91,46.04
GNDA  (via drill 0.3)
  Top 0.254: C63.2
  Top 0.305: 42.23,29.21 42.07,29.05 C65.2 42.08,28.58 | IC1.20 40.33,28.58 40.8,29.05 C64.2
  Top 0.406: v42.39,35.56 42.39,34.92 42.86,34.45 C63.2
  Top 0.61: 42.71,28.89 C65.2 42.38,28.89 40.96,28.89 C64.2 | C62.2 42.76,32.6 42.86,32.7 42.86,34.29 C63.2
  Top 0.813: 42.71,28.89 44.29,28.89 44.77,29.37 44.77,34.13 | 44.77,34.13 C63.2 | 44.77,34.13 SJ6.2
  Bottom 0.254: v42.39,35.56 45.72,35.56 JP7.5
INIT_B  (via drill 0.3)
  Top 0.254: U1.P39 28.73,42.48 28.73,42.07 27.62,40.96 v27.62,39.37 | IC1.36 30.84,34.34 31.43,34.92 v31.43,35.72
  Route15 0.254: v31.43,35.72 30.8,35.72 29.69,36.83 27.94,36.83 27.62,37.15 v27.62,39.37
N$1
  Top 0.61: R2.1 LED1.A
N$2
  Top 0.254: U1.P65 37.82,51.78 37.82,51.08 38.73,50.16 RN3.5
N$3
  Top 0.254: U1.P62 37.96,49.52 RN3.6
N$4  (via drill 0.3)
  Top 0.305: IC1.99 35.34,19.11 v35.4,19.21
  Bottom 0.305: v35.4,19.21 35.56,19.05 36.35,19.05 SJ1.2
N$5
  Top 0.254: U1.P61 37.59,49.18 RN3.7
N$6
  Top 0.254: U1.P59 36.97,48.39 RN3.8
N$7
  Top 0.254: U1.P58 36.05,48.6 36.05,48.15 36.31,47.89 RN6.5
N$8
  Top 0.254: U1.P57 35.49,48.46 35.49,47.37 35.69,47.16 RN6.6
N$9
  Top 0.254: U1.P56 34.93,48.31 34.93,46.8 35.12,46.61 RN6.7
N$10
  Top 0.254: U1.P51 33.46,46.24 34.14,46.24 RN6.8
N$11
  Top 0.254: U1.P50 33.79,45.2 RN7.5
N$12
  Top 0.254: U1.P48 33,44.59 RN7.6
N$13
  Top 0.254: U1.P46 31.72,44.45 32.12,44.45 32.55,44.02 RN7.7
N$14
  Top 0.254: U1.P45 32.03,43.43 RN7.8
N$15
  Top 0.254: U1.P44 30.96,43.8 30.96,41.91 31.43,41.43 31.43,40.96 31.37,40.9 RN4.5
N$16
  Top 0.61: LED3.C 7.36,53.44 7.3,53.5 7.3,55.56 R5.2
N$17
  Bottom 0.254: IC3.19 36.12,52.62 38.26,50.48 SJ2.2
N$18
  Top 0.61: R3.1 LED2.A
N$19  (via drill 0.3)
  Top 0.254: IC1.8 35.12,22.58 v34.45,21.91
  Top 0.406: R8.2 13.71,14.61 12.54,14.61 12.38,14.76 R6.1 12.22,14.71 12.22,14.45 11.43,13.65 v11.43,13.18
  Bottom 0.254: v34.45,21.91 32.7,20.16 27.94,20.16 25.56,17.78 25.56,16.19 24.61,15.24 22.07,15.24 18.26,11.43 12.06,11.43 11.43,12.06 v11.43,13.18
N$20
  Top 0.305: U1.P144 11.07,58.74 10.64,58.74 10.32,58.42 R4.1
  Top 0.61: R5.1 9.21,57.47 10.16,57.47 | R4.1 10.16,57.47 | 10.16,57.47
N$26
  Top 0.61: 44.77,41.75
  Top 0.813: LED9.C 44.77,41.75 R22.2
N$33
  Top 0.61: LED10.C R1.2
N$35
  Top 0.254: U1.P41 29.69,42.95 29.69,41.12 29.7,41.1 RN4.7
N$38
  Top 0.305: IC1.49 24.34,36.25 C66.1
N$39
  Top 0.305: IC1.73 20.4,20.08 19.05,18.73 C67.1
N$41
  Top 0.254: IC1.94 32.84,13.41 R14.2
N$42  (via drill 0.3)
  Top 0.813: X3.M2 X3.M3 | X3.M2 6.66,1.59 6.67,1.59 15.39,1.59 X3.M1 | X3.M1 15.56,1.59 | X3.M1 X3.M4 | X3.M2 v6.66,3.65 v6.67,3.65 | 15.56,1.43 X3.M1 | X3.M1
  Bottom 0.61: 7.3,1.43 7.78,1.43 | v6.67,3.65 7.14,3.65 7.78,3.02
  Bottom 0.813: R10.2 7.78,1.43 7.78,3.02 7.78,3.12 C56.1
N$44
  Top 0.254: U1.P43 30.48,43.57 30.48,40.96 30.5,40.94 RN4.6
N$45
  Top 0.254: U1.P40 29.21,42.72 29.21,41.75 28.82,41.37 RN4.8
N$51
  Top 0.61: CC1.2 RC1.2
N$52
  Top 0.61: CC1.1 7.14,30.8 8.41,30.8 8.73,31.11 IC5.5
N$53
  Top 0.813: L3.1 6.62,27.57 7.78,28.73 9.68,28.73 10.79,29.84 12.06,29.84 12.54,30.32 IC5.8
N$54
  Top 0.406: R30.2 10.47,34.61 9.53,34.61 9.05,34.61 8.41,35.24 8.41,36.83 8.73,37.15 IC5.4
  Top 0.61: R30.2 R27.1
N$55
  Top 0.406: L4.2 13.34,76.83 12.86,76.83 C23.1 12.38,75.25 C9.1 | IC6.3 12.31,75.22 C9.1 | C9.1 12.22,75.25
N$56  (via drill 0.3)
  Top 0.254: v35.88,24.77 36.06,24.58 IC1.12
  Bottom 0.254: v35.88,24.77 35.72,24.92 32.38,24.92 31.11,26.15 Q3.3
P1
  Top 0.254: U1.P1 10.61,54.13 9.68,54.13 8.1,52.55 7.46,51.91 5.87,50.32 5.87,49.21 4.92,48.26 2.54,48.26 JP1.27
P2
  Top 0.254: U1.P2 10.84,53.66 9.84,53.66 8.57,52.39 7.94,51.75 6.35,50.16 6.35,49.05 4.29,46.99 JP1.28
P5
  Top 0.254: U1.P5 9.05,49.74 5.03,45.72 2.54,45.72 JP1.29
P6
  Top 0.254: U1.P6 9.21,49.19 4.46,44.45 JP1.30 4.45,44.45
P7  (via drill 0.3)
  Top 0.254: U1.P7 10.32,49.6 v10.32,49.37
  Bottom 0.254: v10.32,49.37 10.32,49.21 4.29,43.18 2.54,43.18 JP1.31
P8  (via drill 0.3)
  Top 0.254: U1.P8 11.27,49.84 v11.27,49.37
  Bottom 0.254: v11.27,49.37 JP1.32 | JP1.32
P9  (via drill 0.3)
  Top 0.254: U1.P9 12.22,50.09 v12.22,49.53
  Route15 0.254: v8.57,33.97 12.38,37.78 12.38,40.32 12.38,41.75 12.38,43.5 10.95,44.93 10.95,47.78 12.22,49.05 v12.22,49.53
  Bottom 0.254: JP4.11 2.54,27.94 4.13,27.94 8.57,32.38 v8.57,33.97
P10  (via drill 0.3)
  Top 0.254: 11.59,47.78 v11.59,47.31 11.59,47.94 12.86,49.21 12.86,50.02 U1.P10
  Route15 0.254: v11.75,33.5 11.75,35.24 13.81,37.31 13.81,40.01 12.86,40.96 12.86,43.66 11.43,45.09 11.43,47.15 v11.59,47.31 | v11.59,47.31
  Bottom 0.254: JP4.12 6.51,26.67 7.78,27.94 11.11,27.94 11.75,28.57 v11.75,33.5
P11  (via drill 0.3)
  Top 0.254: v12.54,47.47 12.54,48.26 13.34,49.05 13.34,49.78 U1.P11
  Route15 0.254: v12.7,33.5 12.7,35.56 14.29,37.15 14.29,40.16 13.34,41.12 13.34,43.81 11.91,45.24 11.91,46.51 12.54,47.15 v12.54,47.47
  Bottom 0.254: JP4.13 1.91,24.13 3.02,25.24 5.71,25.24 7.94,27.46 11.27,27.46 12.22,28.42 12.22,33.02 v12.7,33.5
P12  (via drill 0.3)
  Top 0.254: U1.P12 13.97,49.71 13.97,48.74 v13.49,48.26 | v13.49,48.26
  Bottom 0.254: v13.49,48.26 13.49,47.62 15.24,45.88 15.24,39.69 14.29,38.73 8.57,38.73 6.19,36.35 6.19,33.66 5.56,33.02 3.17,33.02 1.91,31.75 JP4.7
P14  (via drill 0.3)
  Top 0.254: U1.P14 15.04,49.37 v14.61,49.37
  Bottom 0.254: v14.61,49.37 14.13,48.9 14.13,47.62 15.72,46.04 15.72,39.53 14.45,38.26 8.73,38.26 6.67,36.2 6.67,32.86 5.56,31.75 JP4.8 | v14.61,49.37
P15  (via drill 0.3)
  Top 0.254: U1.P15 14.76,48.39 v14.76,48.1
  Bottom 0.254: v14.76,48.1 14.76,47.62 16.19,46.2 16.19,39.37 14.61,37.78 8.89,37.78 7.14,36.04 7.14,32.54 5.08,30.48 3.17,30.48 1.91,29.21 JP4.9
P16  (via drill 0.3)
  Top 0.254: U1.P16 15.72,48.63 v15.72,48.26
  Bottom 0.254: v15.72,48.26 15.72,47.31 16.67,46.35 16.67,39.21 14.76,37.31 9.05,37.31 7.62,35.88 7.62,32.23 4.6,29.21 JP4.10
P17  (via drill 0.3)
  Top 0.254: U1.P17 18.1,50.3 v18.1,50.8
  Bottom 0.254: v18.1,50.8 18.1,48.1 17.14,47.15 17.14,46.99 17.14,36.04 17.14,32.7 11.43,26.99 8.1,26.99 5.24,24.13 JP4.14
P21  (via drill 0.3)
  Top 0.254: U1.P21 19.99,49.37 v20.32,49.37
  Bottom 0.254: v20.32,49.37 20,49.37 19.61,48.97 19.13,48.5 19.05,48.42 17.62,46.99 17.62,44.77 17.62,35.88 17.62,32.54 11.59,26.51 8.26,26.51 4.6,22.86 2.54,22.86 JP4.15 | v20.32,49.37
P22  (via drill 0.3)
  Top 0.254: U1.P22 20.06,48.74 v21.11,48.74
  Bottom 0.254: v21.11,48.74 21.11,48.58 21.43,48.26 21.43,46.83 23.65,44.61 23.65,40.01 23.65,38.42 23.65,37.31 11.91,25.56 8.57,25.56 5.24,22.23 5.24,20.8 4.76,20.32 2.54,20.32 JP4.17
P23  (via drill 0.3)
  Top 0.254: U1.P23 20.14,48.1 v20.48,48.1
  Bottom 0.254: v20.48,48.1 20.64,48.1 20.95,47.78 20.95,46.67 23.18,44.45 23.18,37.47 11.75,26.04 8.41,26.04 3.97,21.59 JP4.16
P34  (via drill 0.3)
  Top 0.254: U1.P34 22.54,42.73 22.54,41.91 23.34,41.12 v24.77,41.12
  Bottom 0.254: v24.77,41.12 26.04,42.39 30.64,42.39 33.02,44.77 35.88,44.77 37.78,46.67 40.32,46.67 43.66,43.34 43.66,38.42 46.51,35.56 48.26,35.56 JP7.4
P35  (via drill 0.3)
  Top 0.254: U1.P35 24.45,43.93 v24.45,44.29
  Bottom 0.254: v24.45,44.29 24.45,43.34 24.92,42.86 30.48,42.86 32.86,45.24 35.72,45.24 37.62,47.15 40.48,47.15 44.13,43.5 44.13,38.73 46.04,36.83 JP7.3
P38  (via drill 0.3)
  Top 0.254: U1.P38 26.7,43.81 v26.19,43.81
  Bottom 0.254: v26.19,43.81 26.67,43.34 30.32,43.34 32.7,45.72 35.56,45.72 37.47,47.62 40.64,47.62 44.61,43.66 44.61,39.05 45.56,38.1 48.26,38.1 JP7.2
P66  (via drill 0.3)
  Top 0.254: U1.P66 38.88,51.44 40.32,51.44 41.59,50.16 v41.59,48.58
  Bottom 0.254: v41.59,48.58 41.59,48.42 41.59,47.31 45.09,43.81 45.09,40.01 45.72,39.37 JP7.1
P67  (via drill 0.3)
  Top 0.254: U1.P67 39.11,51.91 40.48,51.91 42.23,50.16 v42.23,49.21
  Bottom 0.254: v42.23,49.21 42.23,47.31 45.56,43.97 45.56,41.43 46.35,40.64 48.26,40.64 JP6.32
P74
  Top 0.254: U1.P74 39.89,59.37 41.75,59.37 42.23,58.9 42.23,55.56 43.81,53.98 43.81,45.4 46.99,42.23 JP6.31
P75
  Top 0.254: U1.P75 39.66,59.85 41.91,59.85 42.7,59.05 42.7,58.26 42.7,55.72 44.29,54.13 44.29,45.56 46.67,43.18 48.26,43.18 JP6.30
P78
  Top 0.254: U1.P78 40.88,63.18 42.86,63.18 43.02,63.02 | 43.02,63.02 | 43.02,63.02 43.18,62.87 43.18,60.33 43.18,60.01 43.18,55.88 44.77,54.29 44.77,45.72 46.04,44.45 JP6.29
P79
  Top 0.254: U1.P79 40.64,63.66 43.02,63.66 43.66,63.02 43.66,56.04 45.24,54.45 45.24,49.05 46.04,48.26 48.26,48.26 JP6.28
P80
  Top 0.254: U1.P80 40.41,64.14 43.18,64.14 44.13,63.18 44.13,60.01 44.13,59.69 | 44.13,59.69 | 44.13,59.69 45.88,57.94 45.88,56.52 46.51,55.88 48.26,55.88 JP6.20
P81
  Top 0.254: U1.P81 40.18,64.61 43.34,64.61 44.61,63.34 44.61,59.85 46.99,57.47 JP6.19
P82
  Top 0.254: U1.P82 39.95,65.09 43.5,65.09 45.09,63.5 45.09,60.01 46.67,58.42 48.26,58.42 JP6.18
P83
  Top 0.254: U1.P83 39.72,65.56 43.66,65.56 45.56,63.66 45.56,60.17 46.04,59.69 JP6.17
P84  (via drill 0.3)
  Top 0.254: U1.P84 34.61,61.16 v34.61,60.48
  Route15 0.254: v34.61,60.48 41.91,60.48 | 41.91,60.48 | 41.91,60.48 42.23,60.48 v42.55,60.17
  Bottom 0.254: v42.55,60.17 42.86,60.48 46.04,60.48 46.67,61.12 48.42,61.12 JP6.16
P85  (via drill 0.3)
  Top 0.254: U1.P85 36.4,63.66 v36.83,63.66
  Bottom 0.254: v36.83,63.66 | v36.83,63.66 | v36.83,63.66 36.83,63.02 38.89,60.96 45.72,60.96 JP6.15
P87  (via drill 0.3)
  Top 0.254: U1.P87 33.72,62.39 v33.18,62.39
  Route15 0.254: v33.18,62.39 39.53,62.39 40.01,62.87 41.27,62.87 v41.59,62.55
  Bottom 0.254: v41.59,62.55 42.55,63.5 48.26,63.5 JP6.14
P88  (via drill 0.3)
  Top 0.254: U1.P88 35.23,64.61 v35.56,64.61
  Bottom 0.254: v35.56,64.61 | v35.56,64.61 35.72,64.77 JP6.13
P92
  Top 0.254: U1.P92 34.77,66.97 34.77,67.47 36.67,69.37 39.21,69.37 42.55,66.04 48.26,66.04 JP6.12
P93
  Top 0.254: U1.P93 34.29,67.2 34.29,67.79 36.35,69.85 39.37,69.85 42.7,66.52 46.2,66.52 JP6.11
P94
  Top 0.254: JP6.10 48.18,68.5 46.59,68.5 45.09,66.99 42.86,66.99 39.53,70.33 36.23,70.33 33.81,67.94 33.81,67.44 U1.P94
P95  (via drill 0.3)
  Top 0.254: U1.P95 33.34,67.67 v33.34,68.42
  Bottom 0.254: v33.34,68.42 33.66,68.74 36.2,68.74 37.31,69.85 JP6.9
P97_IO7  (via drill 0.3)
  Top 0.254: U1.P97 32.04,67.79 v32.54,67.79
  Bottom 0.254: v32.54,67.79 32.54,68.58 33.18,69.22 36.04,69.22 37.15,70.33 42.23,70.33 43.12,71.22 | JP6.8 48.26,71.12 43.22,71.12 43.12,71.22 | IC3.44 43.12,71.22
P98_IO6  (via drill 0.3)
  Top 0.254: U1.P98 32.61,69.06 34.29,69.06 36.04,70.8 40.32,70.8 v41.59,72.07 41.91,72.39 JP6.7
  Bottom 0.254: IC3.43 42.62,73.1 v41.59,72.07
P99_IO5  (via drill 0.3)
  Top 0.254: U1.P99 32.38,69.53 33.97,69.53 35.72,71.28 39.69,71.28 v40.48,72.07 41.27,72.87 45.72,72.87 46.51,73.66 48.26,73.66 JP6.6
  Bottom 0.254: IC3.42 42.12,73.71 v40.48,72.07
P100_IO4  (via drill 0.3)
  Top 0.254: U1.P100 32.14,70.01 33.66,70.01 35.4,71.75 39.05,71.75 v40.32,73.03 40.64,73.34 45.4,73.34 JP6.5
  Bottom 0.254: IC3.41 41.62,74.32 v40.32,73.03
P101_IO3  (via drill 0.3)
  Top 0.254: U1.P101 30.8,69.37 v30.8,69.69
  Bottom 0.254: v30.8,69.69 35.88,69.69 37.15,70.96 37.15,77.03 IC3.32 37.12,78.71 37.62,79.22 44.29,79.22 45.88,77.63 45.88,76.83 46.35,76.36 48.42,76.36 JP6.4
P102_IO2  (via drill 0.3)
  Top 0.254: U1.P102 28.1,67.38 v28.1,66.99
  Route15 0.254: v28.1,66.99 29.69,66.99 v34.13,71.44
  Bottom 0.254: JP6.3 46.83,77.63 46.2,77.95 44.45,79.69 37.31,79.69 36.62,79.01 IC3.31 36.62,72.02 36.04,71.44 v34.13,71.44
P104_IO1  (via drill 0.3)
  Top 0.254: U1.P104 30.32,71.01 30.32,72.55 30.64,72.87 34.61,72.87 v35.08,73.34
  Bottom 0.254: v35.08,73.34 35.72,73.98 36.12,74.38 IC3.30 36.12,79.3 36.99,80.17 44.61,80.17 45.88,78.9 48.58,78.9 JP6.2 | v35.08,73.34
P105_IO0  (via drill 0.3)
  Top 0.254: U1.P105 29.84,71.25 29.84,72.71 30.48,73.34 34.13,73.34 v35.08,74.3
  Bottom 0.254: v35.08,74.3 35.24,74.3 35.62,74.67 IC3.29 35.62,79.59 36.67,80.64 44.77,80.64 45.4,80.01 JP6.1 | v35.08,74.3
P111_R/B#  (via drill 0.3)
  Top 0.254: U1.P111 21.91,71.23 v21.91,71.6
  Bottom 0.254: v21.91,71.6 22.38,71.12 27.94,71.28 38.73,60.48 40.64,60.48 42.12,59 42.12,57.63 | IC3.7 42.12,57.63 | 42.12,57.63 42.7,57.63 | 42.7,57.63 43.02,57.63 | 43.02,57.63 43.5,57.63 43.62,57.5 IC3.4 43.62,55.28 44.29,54.61 JP6.21 | IC3.5 43.12,57.53 43.02,57.63 | IC3.6 42.62,57.54 42.7,57.63
P112_RE#  (via drill 0.3)
  Top 0.254: U1.P112 21.79,70.64 v21.11,71.12
  Bottom 0.254: v21.11,71.12 21.27,70.96 21.75,70.64 26.99,70.64 27.94,70.64 36.2,62.39 38.58,60.01 40.48,60.01 41.62,58.87 IC3.8 41.62,55.38 43.5,53.5 48.42,53.5 JP6.22
P114_CE0#  (via drill 0.3)
  Top 0.254: U1.P114 24.02,66.99 v24.45,66.99
  Bottom 0.254: v24.45,66.99 25.4,66.99 26.04,66.36 31.59,66.36 38.42,59.53 40.32,59.53 41.12,58.73 IC3.9 41.12,55.24 44.29,52.07 JP6.23
P115_CE1#  (via drill 0.3)
  Top 0.254: U1.P115 23.95,66.36 v25.08,66.36
  Bottom 0.254: v25.08,66.36 25.56,65.88 31.43,65.88 38.26,59.05 40.16,59.05 40.62,58.6 IC3.10 40.62,55.11 44.93,50.8 48.26,50.8 JP6.24
P116_CLE  (via drill 0.3)
  Top 0.254: U1.P116 23.88,65.72 v24.45,65.72
  Bottom 0.254: v24.45,65.72 24.77,65.41 31.27,65.41 37.62,59.06 IC3.16 37.62,53.03 39.21,51.44 43.66,51.44 45.56,49.53 JP6.25
P117_ALE  (via drill 0.3)
  Top 0.254: U1.P117 23.81,65.09 v23.65,65.09
  Bottom 0.254: v23.65,65.09 23.81,64.93 26.51,64.93 31.59,59.85 36.2,59.85 37.12,58.92 IC3.17 37.12,52.89 39.05,50.96 43.5,50.96 46.2,48.26 48.26,48.26 JP6.26
P118_WE#  (via drill 0.3)
  Top 0.254: U1.P118 22.94,65.25 v23.02,64.45
  Bottom 0.254: v23.02,64.45 26.35,64.45 31.43,59.37 36.04,59.37 36.62,58.79 IC3.18 36.62,52.76 38.89,50.48 43.34,50.48 46.67,47.15 JP6.27
P119  (via drill 0.3)
  Top 0.254: U1.P119 21.75,65.73 v21.75,65.09
  Bottom 0.254: 21.75,64.77 v21.75,65.09 21.75,64.29 18.26,60.8 | 18.26,60.8 | 18.26,60.8 17.94,60.48 16.99,60.48 14.45,63.02 12.86,63.02 10.32,60.48 6.51,60.48 4.68,58.66 2.3,58.66 JP1.17
P120  (via drill 0.3)
  Top 0.254: U1.P120 20.95,65.82 v20.95,65.56
  Bottom 0.254: v20.95,65.56 20.95,64.14 17.78,60.96 17.14,60.96 14.61,63.5 12.7,63.5 10.16,60.96 5.08,60.96 JP1.18
P134  (via drill 0.3)
  Top 0.254: 13.34,62.55 v13.18,62.39 13.49,62.71 14.17,62.71 U1.P134
  Bottom 0.254: JP1.19 2.3,58.18 4.84,58.18 6.67,60.01 10.79,60.01 v13.18,62.39
P137  (via drill 0.3)